# EAGLE design TestA (EAGLE 9.6.2)
IGNORE_RENUMBER: TP
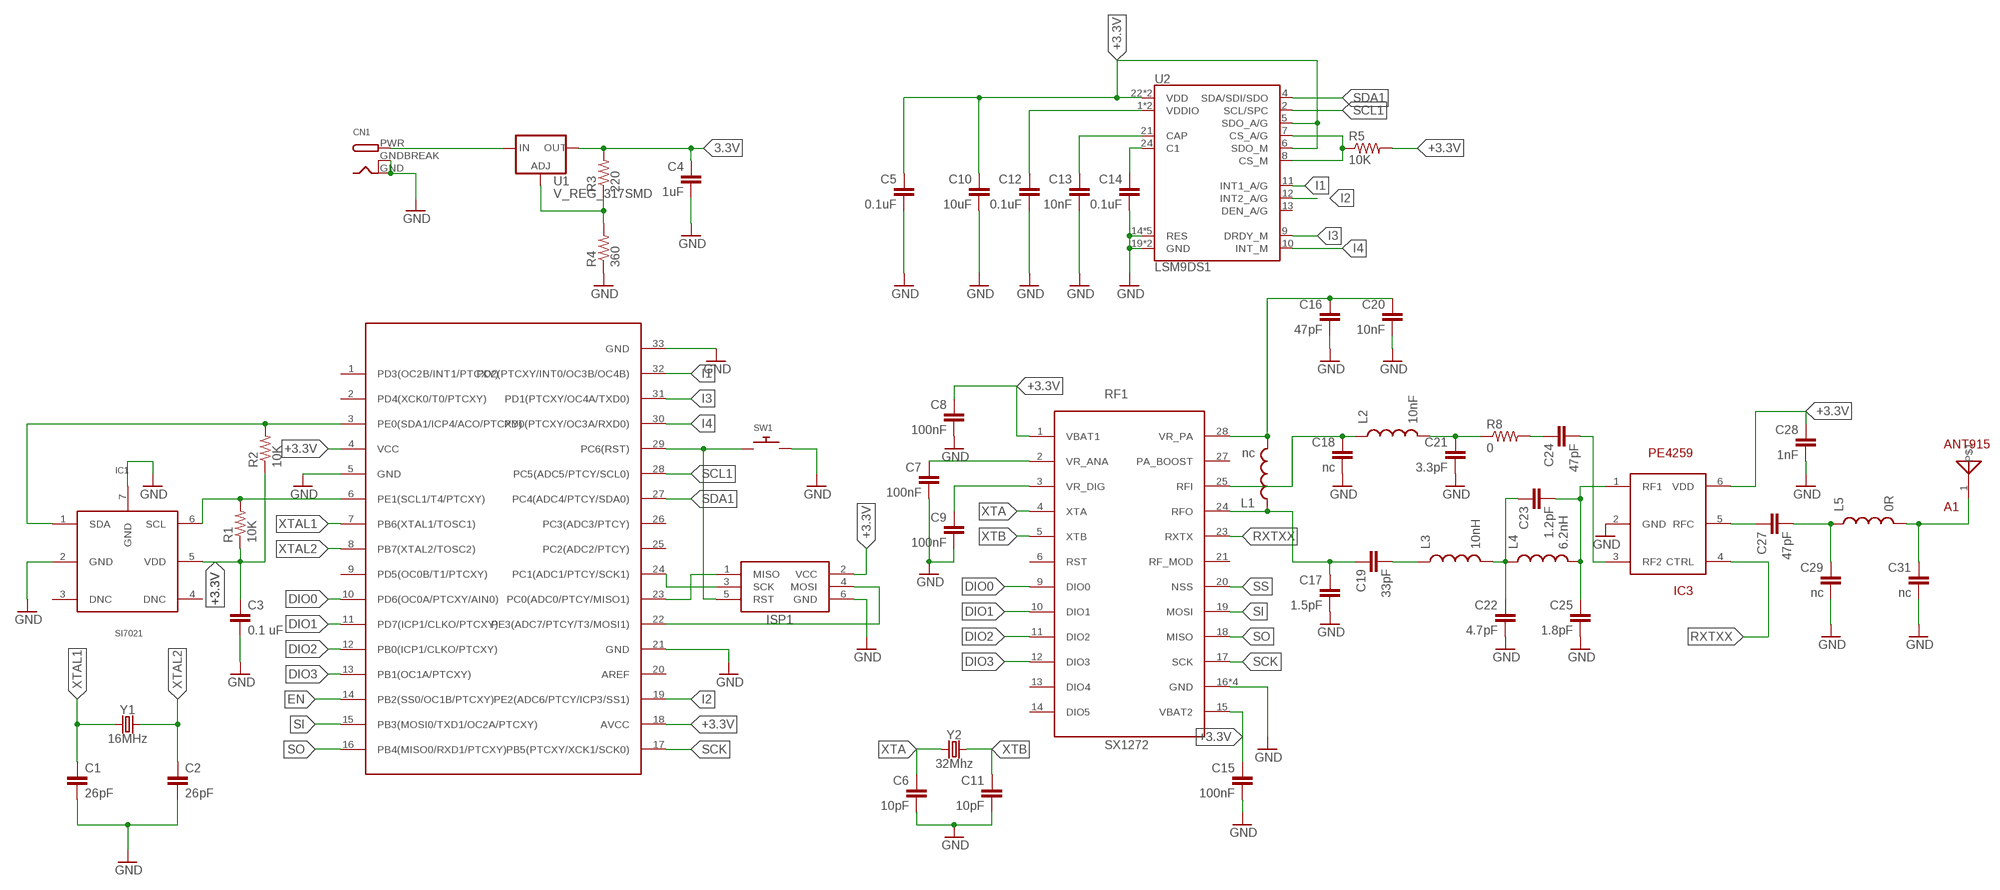
[diagram p0: schematic, sheet 1]

## Parts
A1  ANT915  [ANT915]
C1  26pF  CAP0402-CAP  [0402-CAP]
C2  26pF  CAP0402-CAP  [0402-CAP]
C3  0.1 uF  CAP0402-CAP  [0402-CAP]
C4  1uF  CAP0402-CAP  [0402-CAP]
C5  0.1uF  CAP0402-CAP  [0402-CAP]
C6  10pF  CAP0402-CAP  [0402-CAP]
C7  100nF  CAP0402-CAP  [0402-CAP]
C8  100nF  CAP0402-CAP  [0402-CAP]
C9  100nF  CAP0402-CAP  [0402-CAP]
C10  10uF  CAP0402-CAP  [0402-CAP]
C11  10pF  CAP0402-CAP  [0402-CAP]
C12  0.1uF  CAP0402-CAP  [0402-CAP]
C13  10nF  CAP0402-CAP  [0402-CAP]
C14  0.1uF  CAP0402-CAP  [0402-CAP]
C15  100nF  CAP0402-CAP  [0402-CAP]
C16  47pF  CAP0402-CAP  [0402-CAP]
C17  1.5pF  CAP0402-CAP  [0402-CAP]
C18  nc  CAP0402-CAP  [0402-CAP]
C19  33pF  CAP0402-CAP  [0402-CAP]
C20  10nF  CAP0402-CAP  [0402-CAP]
C21  3.3pF  CAP0402-CAP  [0402-CAP]
C22  4.7pF  CAP0402-CAP  [0402-CAP]
C23  1.2pF  CAP0402-CAP  [0402-CAP]
C24  47pF  CAP0402-CAP  [0402-CAP]
C25  1.8pF  CAP0402-CAP  [0402-CAP]
C27  47pF  CAP0402-CAP  [0402-CAP]
C28  1nF  CAP0402-CAP  [0402-CAP]
C29  nc  CAP0402-CAP  [0402-CAP]
C31  nc  CAP0402-CAP  [0402-CAP]
CN1  DCBARRELPTH  [DCJACK_2MM_PTH]
IC1  SI7021  [SI7021]
IC2  ATMEGA328-PB  [ATMEGA328-PB]
IC3  PE4259  [PE4259]
ISP1  AVRISP-6  [AVRISP]
L1  nc  INDUCTOR0402  [C0402]
L2  10nF  INDUCTOR0402  [C0402]
L3  10nH  INDUCTOR0402  [C0402]
L4  6.2nH  INDUCTOR0402  [C0402]
L5  0R  INDUCTOR0402  [C0402]
R1  10K  RESISTOR0402-RES  [0402-RES]
R2  10K  RESISTOR0402-RES  [0402-RES]
R3  220  RESISTOR0402-RES  [0402-RES]
R4  360  RESISTOR0402-RES  [0402-RES]
R5  10K  RESISTOR0402-RES  [0402-RES]
R8  0  RESISTOR0402-RES  [0402-RES]
RF1  SX1272  [SX1272]
SW1  SWITCH_PUSHBUTTONSOFTTOUCHSMD_SJ  [PUSHBUTTON_SMD_SJ]
U1  V_REG_317SMD  [SOT223]
U2  LSM9DS1  [LGA24-8X4]
Y1  16MHz  CRYSTAL-16MHZSMD-2X1.6  [CRYSTAL-SMD-2.0X1.6MM]
Y2  32Mhz  CRYSTAL-16MHZSMD-2X1.6  [CRYSTAL-SMD-2.0X1.6MM]

## Nets
3.3V: C4.1 R3.2 U1.2(OUT)
+3.3V: C3.1 C5.1 C8.1 C10.1 C15.1 C28.1 IC1.5(VDD) IC2.4(VCC) IC2.18(AVCC) IC3.6(VDD) ISP1.2(VCC) R1.1 R2.1 R5.2 RF1.1(VBAT1) RF1.15(VBAT2) U2.5(SDO_A/G) U2.6(SDO_M) U2.22(VDD) U2.23(VDD)
DIO0: IC2.10(PD6(OC0A/PTCXY/AIN0)) RF1.9(DIO0)
DIO1: IC2.11(PD7(ICP1/CLKO/PTCXY)) RF1.10(DIO1)
DIO2: IC2.12(PB0(ICP1/CLKO/PTCXY)) RF1.11(DIO2)
DIO3: IC2.13(PB1(OC1A/PTCXY)) RF1.12(DIO3)
EN: IC2.14(PB2(SS0/OC1B/PTCXY))
GND: C1.2 C2.2 C3.2 C4.2 C5.2 C6.2 C7.2 C8.2 C9.2 C10.2 C11.2 C12.2 C13.2 C14.2 C15.2 C16.2 C17.2 C18.2 C20.2 C21.2 C22.2 C25.2 C28.2 C29.2 C31.2 CN1.GND CN1.GNDBREAK IC1.2(GND) IC1.7(GND) IC2.5(GND) IC2.21(GND) IC2.33(GND) IC3.2(GND) ISP1.6(GND) R4.1 RF1.16(GND) RF1.22(GND) RF1.26(GND) RF1.29(GND) SW1.P$2 U2.14(RES) U2.15(RES) U2.16(RES) U2.17(RES) U2.18(RES) U2.19(GND) U2.20(GND)
I1: IC2.32(PD2(PTCXY/INT0/OC3B/OC4B)) U2.11(INT1_A/G)
I2: IC2.19(PE2(ADC6/PTCY/ICP3/SS1)) U2.12(INT2_A/G)
I3: IC2.31(PD1(PTCXY/OC4A/TXD0)) U2.9(DRDY_M)
I4: IC2.30(PD0(PTCXY/OC3A/RXD0)) U2.10(INT_M)
N$1: C24.1 R8.2
N$2: C16.1 C20.1 L1.2 RF1.28(VR_PA)
N$3: CN1.PWR U1.3(IN)
N$4: C24.2 IC3.3(RF2)
N$5: R5.1 U2.7(CS_A/G) U2.8(CS_M)
N$6: R3.1 R4.2 U1.1(ADJ)
N$7: C18.1 L2.1 RF1.25(RFI)
N$8: C13.1 U2.21(CAP)
N$9: C12.1 U2.1(VDDIO) U2.3(VDDIO)
N$10: C21.1 L2.2 R8.1
N$11: C17.1 C19.1 L1.1 RF1.24(RFO)
N$12: C22.1 C23.1 L3.2 L4.1
N$13: C19.2 L3.1
N$14: C23.2 C25.1 IC3.1(RF1) L4.2
N$15: A1.1 C31.1 L5.2
N$16: C27.1 IC3.5(RFC)
N$17: C14.1 U2.24(C1)
N$18: C27.2 C29.1 L5.1
N$22: IC2.29(PC6(RST)) ISP1.5(RST) SW1.P$1
N$23: IC2.24(PC1(ADC1/PTCY/SCK1)) ISP1.3(SCK)
N$24: C7.1 RF1.2(VR_ANA)
N$25: C9.1 RF1.3(VR_DIG)
N$26: IC2.23(PC0(ADC0/PTCY/MISO1)) ISP1.1(MISO)
N$27: IC2.22(PE3(ADC7/PTCY/T3/MOSI1)) ISP1.4(MOSI)
RXTXX: IC3.4(CTRL) RF1.23(RXTX)
SCK: IC2.17(PB5(PTCXY/XCK1/SCK0)) RF1.17(SCK)
SCL: IC1.6(SCL) IC2.6(PE1(SCL1/T4/PTCXY)) R1.2
SCL1: IC2.28(PC5(ADC5/PTCY/SCL0)) U2.2(SCL/SPC)
SDA: IC1.1(SDA) IC2.3(PE0(SDA1/ICP4/ACO/PTCXY)) R2.2
SDA1: IC2.27(PC4(ADC4/PTCY/SDA0)) U2.4(SDA/SDI/SDO)
SI: IC2.15(PB3(MOSI0/TXD1/OC2A/PTCXY)) RF1.19(MOSI)
SO: IC2.16(PB4(MISO0/RXD1/PTCXY)) RF1.18(MISO)
SS: RF1.20(NSS)
XTA: C6.1 RF1.4(XTA) Y2.1
XTAL1: C1.1 IC2.7(PB6(XTAL1/TOSC1)) Y1.1
XTAL2: C2.1 IC2.8(PB7(XTAL2/TOSC2)) Y1.3
XTB: C11.1 RF1.5(XTB) Y2.3
Unconnected: IC1.3(DNC) IC1.4(DNC) IC2.1(PD3(OC2B/INT1/PTCXY)) IC2.2(PD4(XCK0/T0/PTCXY)) IC2.9(PD5(OC0B/T1/PTCXY)) IC2.20(AREF) IC2.25(PC2(ADC2/PTCY)) IC2.26(PC3(ADC3/PTCY)) RF1.6(RST) RF1.13(DIO4) RF1.14(DIO5) RF1.21(RF_MOD) RF1.27(PA_BOOST) U2.13(DEN_A/G)

## Library data of the parts
A1 = Mini-Project:ANT915
C1-C25 C27-C29 C31 = SparkFun:CAP: Capacitor Standard 0603 ceramic capacitor, and 0.1" leaded capacitor.
CN1 = adafruit:DCBARREL: 2.0mm DC Barrel Jack DCJACK_2MM_PTH - Through Hole Jack (4UConnector: 05537)
IC1 = Mini-Project:SI7021
IC2 = Mini-Project:ATMEGA328-PB
IC3 = Mini-Project:PE4259
ISP1 = adafruit:AVRISP: AVR ISP HEADER Standard 6 pin header for AVR programming
L1-L5 = SparkFun:INDUCTOR: Inductors Basic Inductor/Choke - 0603 and 1206. Footprints are not proven and vary greatly between part numbers.
R1-R5 R8 = SparkFun:RESISTOR: Resistor Basic schematic elements and footprints for 0603, 1206, and PTH resistors.
RF1 = Mini-Project:SX1272
SW1 = adafruit:SWITCH_PUSHBUTTON: Buttons SOFTTOUCHSMD_SJ - Soft touch temporary push button (Super Junk Akihabara) Compatible with SKPMANE010 [Mouser: 688-SKPMAN] C&K_KSS = Digikey: KSS221GLFS
U1 = SparkFun:V_REG_317: Voltage Regulator Standard LM317 adjustable voltage regulator. AOI (Adjust Output Input). Google 'LM317 Calculator' for easy to use app to get the two resistor values needed. 240/720 for 5V output. 240/390 for 3.3V output. Spark Fun Electronics SKU : COM-00527
U2 = LSM9DS1:LSM9DS1: LSM9DS1 3D accelerometer, gyroscope & magnetometer The LSM9DS1 is a system-in-package featuring a 3D digital linear acceleration sensor, a 3D digital angular rate sensor, and a 3D digital magnetic sensor. The LSM9DS1 has a linear acceleration full scale of ±2g/±4g/±8/±16 g, a magnetic field full scale of ±4/±8/±12/±16 gauss and an angular rate of ±245/±500/±2000 dps. The LSM9DS1 includes an I2 C serial bus interface supporting standard and fast mode (100 kHz and 400 kHz) and an SPI serial standard interface. Magnetic, accelerometer and gyroscope sensing can be enabled or set in power-down mode separately for smart power management. The LSM9DS1 is available in a plastic land grid array package (LGA) and it is guaranteed to operate over an extended temperature range from -40 °C to +85 °C.; PROD_ID: IC-12536
Y1 = SparkFun-Clocks:CRYSTAL-16MHZ: 16MHz Crystal Digikey Example <http://www.digikey.com/product-search/en?keywords=535-9122-1-ND> Frequency: 16MHz Frequency Stability: ±50ppm Frequency Tolerance: ±20ppm Load Capacitance: 18pF SparkFun Products: Pro Micro -5V/16MHz <https://www.sparkfun.com/products/12640> SparkFun Serial Enabled LCD Kit <https://www.sparkfun.com/products/10097>; PROD_ID: XTAL-14681
Y2 = SparkFun-Clocks:CRYSTAL-16MHZ: 16MHz Crystal Digikey Example <http://www.digikey.com/product-search/en?keywords=535-9122-1-ND> Frequency: 16MHz Frequency Stability: ±50ppm Frequency Tolerance: ±20ppm Load Capacitance: 18pF SparkFun Products: Pro Micro -5V/16MHz <https://www.sparkfun.com/products/12640> SparkFun Serial Enabled LCD Kit <https://www.sparkfun.com/products/10097>; PROD_ID: XTAL-14681; VALUE: 16MHz

## Board
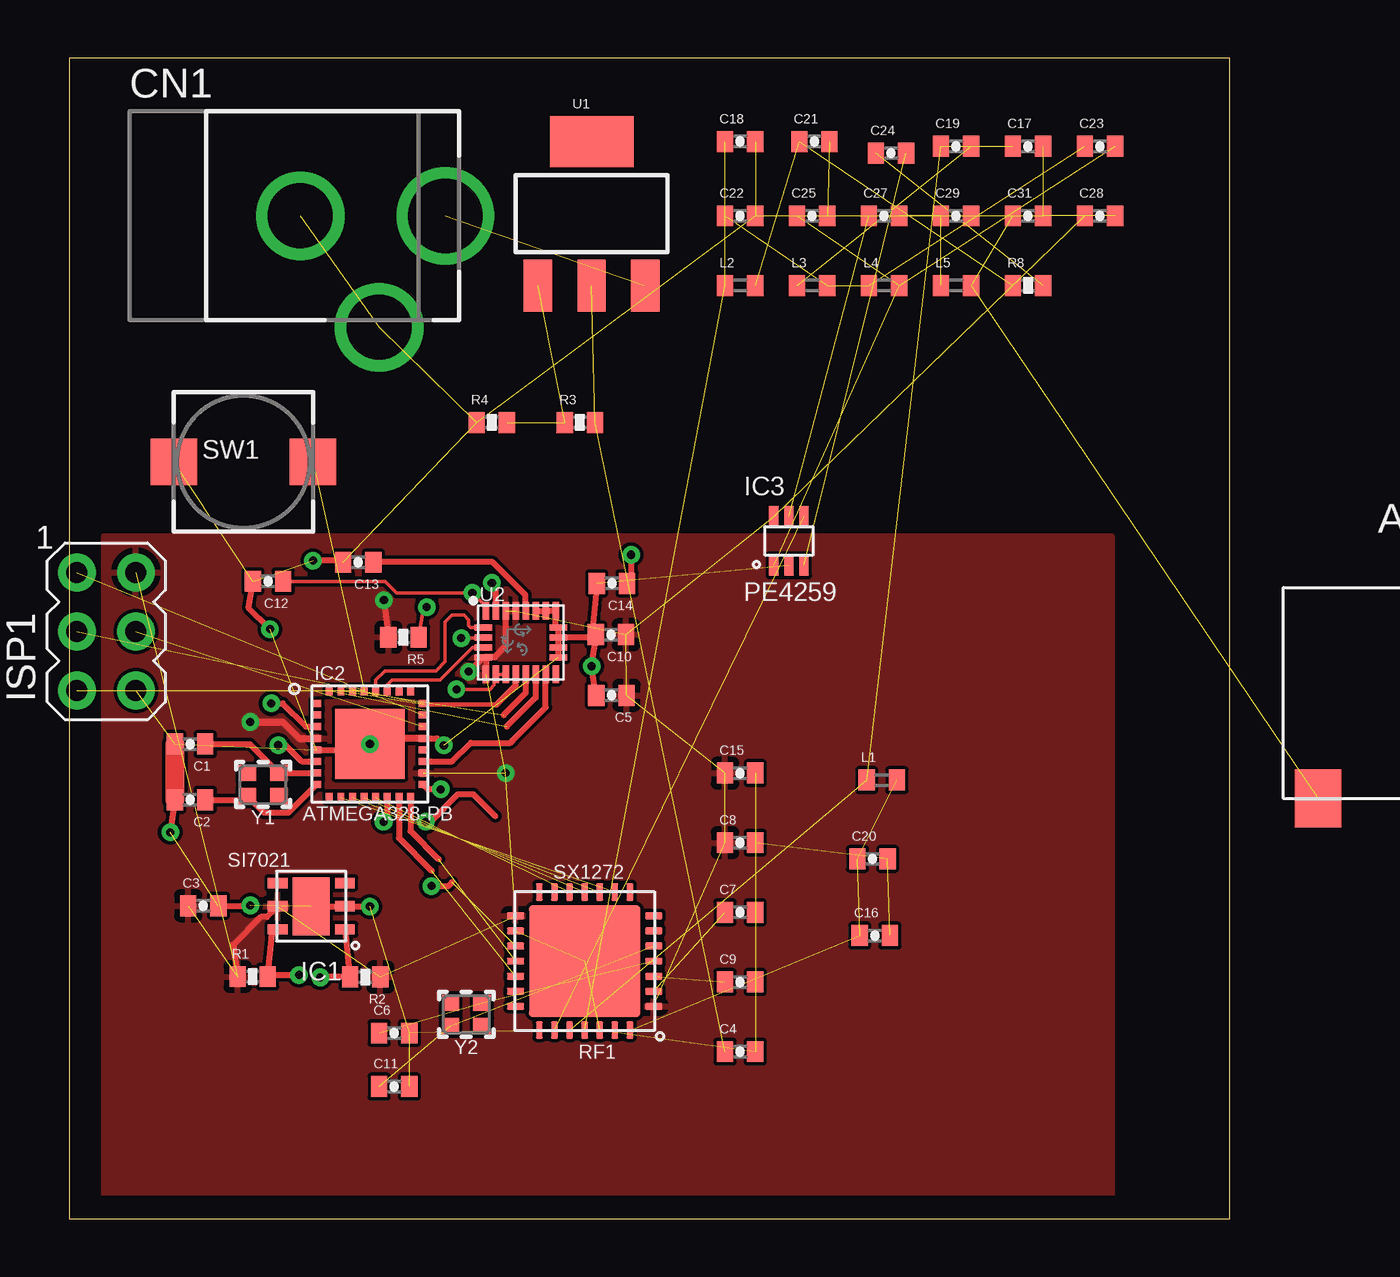
[diagram p1: board, top side]
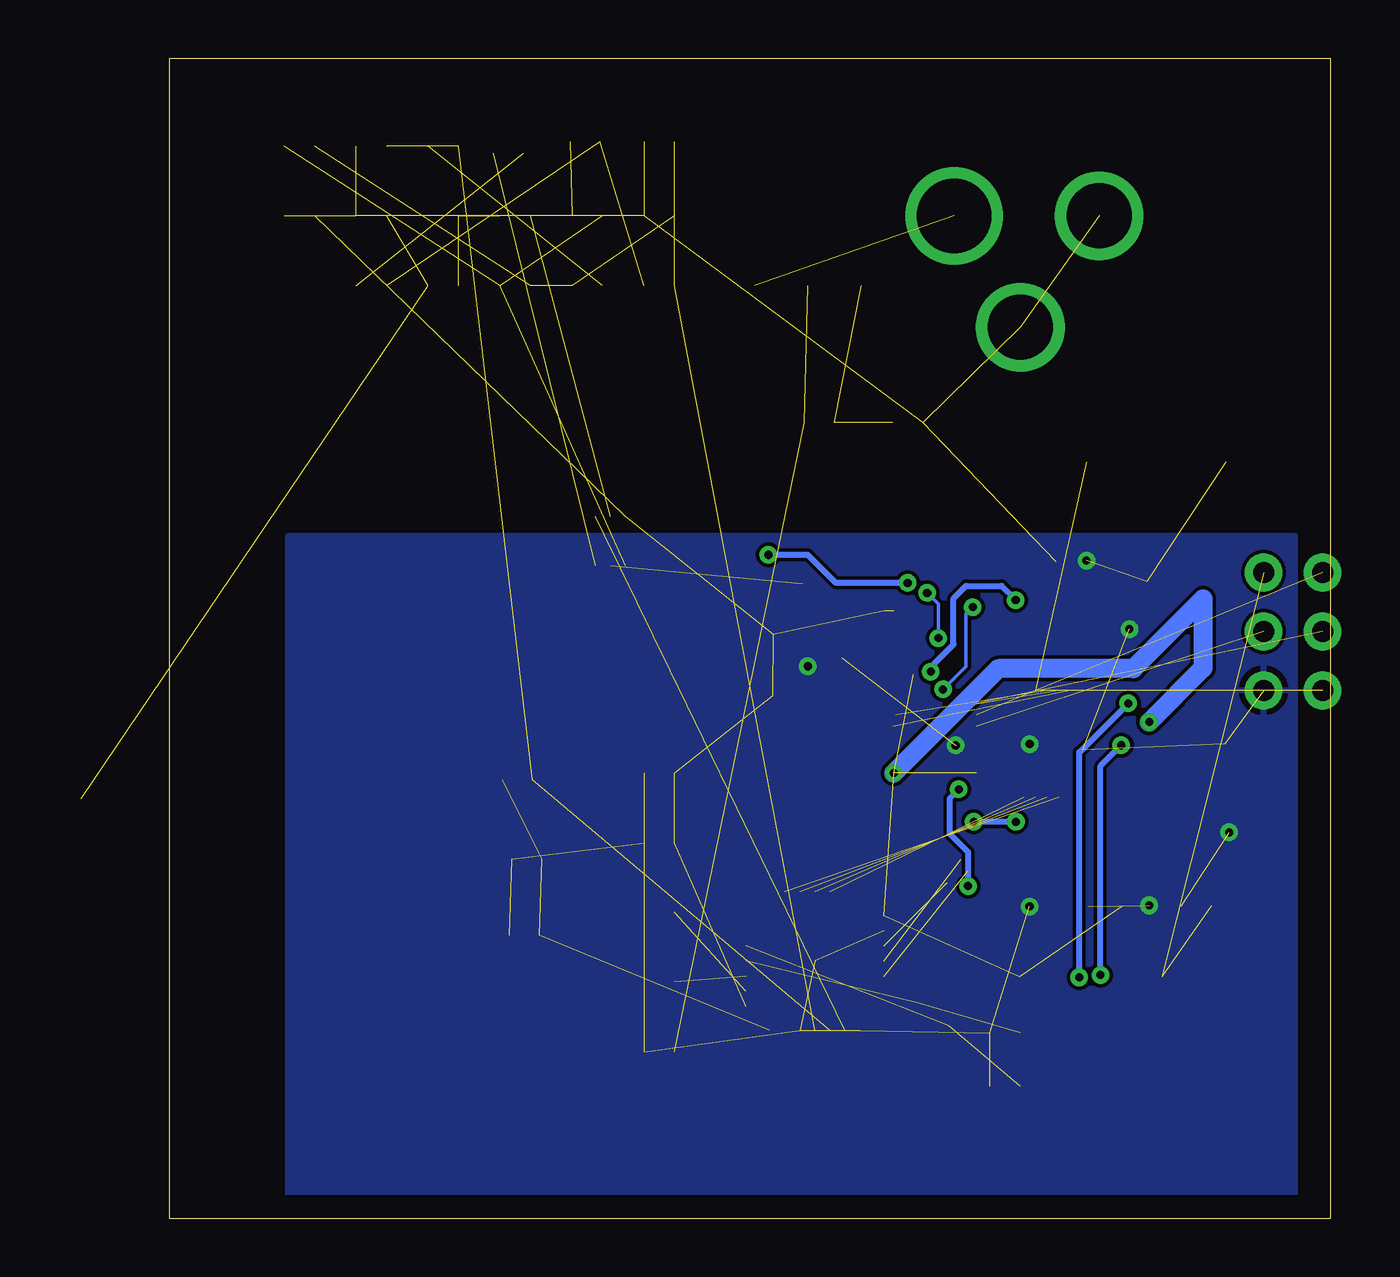
[diagram p2: board, bottom side, seen from below]

Size 50 x 50 mm. Coordinates in mm from the lower left corner, seen from the top.
Outline: 0,0 50,0 50,50 0,50 0,0
Copper layers (1*16): Top 0.035mm / dielectric 1.5mm / Bottom 0.035mm
Design rules "default": minimum track width 6mil, minimum drill 0.35mm, track to track 6mil, track to pad 6mil, pad to pad 6mil, via to via 6mil, smd to smd 6mil, copper to edge 40mil, drill to drill 6mil, minimum pad ring 10mil, minimum via ring 8mil, stop-mask expansion 4mil, vias tented up to drill 0mil, thermal gap 10mil

### Footprints (pad centres in the part's own frame; a part is rotated, then mirrored left to right if it is on the bottom)
ANT915 = smd 2 x 2.5: 1 -5.1,0; 2 5.1,0
0402-CAP = smd 0.7 x 0.9: 1 -0.65,0; 2 0.65,0
DCJACK_2MM_PTH = drill 2.8: GND 0,7.35; GNDBREAK 4.8,10.75 | drill 3.2: PWR 0,13.6
SI7021 = smd 0.85 x 0.45: 1 -1.45,1; 2 -1.45,0; 3 -1.45,-1; 4 1.45,-1; 5 1.45,0; 6 1.45,1 | smd 1.6 x 2.5: 7 0,0
ATMEGA328-PB = smd 0.4 x 0.3: 1 -2.3,1.75; 2 -2.3,1.25; 3 -2.3,0.75; 4 -2.3,0.25; 5 -2.3,-0.25; 6 -2.3,-0.75; 7 -2.3,-1.25; 8 -2.3,-1.75; 17 2.3,-1.75; 18 2.3,-1.25; 19 2.3,-0.75; 20 2.3,-0.25; 21 2.3,0.25; 22 2.3,0.75; 23 2.3,1.25; 24 2.3,1.75 | smd 0.3 x 0.4: 9 -1.75,-2.3; 10 -1.25,-2.3; 11 -0.75,-2.3; 12 -0.25,-2.3; 13 0.25,-2.3; 14 0.75,-2.3; 15 1.25,-2.3; 16 1.75,-2.3; 25 1.75,2.3; 26 1.25,2.3; 27 0.75,2.3; 28 0.25,2.3; 29 -0.25,2.3; 30 -0.75,2.3; 31 -1.25,2.3; 32 -1.75,2.3 | smd 3 x 3: 33 0,0
PE4259 = smd 0.4 x 0.9: 1 -0.65,-1.05; 2 0,-1.05; 3 0.65,-1.05; 4 0.65,1.05; 5 0,1.05; 6 -0.65,1.05
AVRISP = drill 0.9 pad 1.626: 1 -1.27,2.54; 2 1.27,2.54; 3 -1.27,0; 4 1.27,0; 5 -1.27,-2.54; 6 1.27,-2.54
C0402 = smd 0.7 x 0.9: 1 -0.65,0; 2 0.65,0
0402-RES = smd 0.7 x 0.9: 1 -0.65,0; 2 0.65,0
SX1272 = smd 0.75 x 0.3: 1 -2.975,1.95; 2 -2.975,1.3; 3 -2.975,0.65; 4 -2.975,0; 5 -2.975,-0.65; 6 -2.975,-1.3; 7 -2.975,-1.95; 15 2.975,-1.95; 16 2.975,-1.3; 17 2.975,-0.65; 18 2.975,0; 19 2.975,0.65; 20 2.975,1.3; 21 2.975,1.95 | smd 0.3 x 0.75: 8 -1.95,-2.975; 9 -1.3,-2.975; 10 -0.65,-2.975; 11 0,-2.975; 12 0.65,-2.975; 13 1.3,-2.975; 14 1.95,-2.975; 22 1.95,2.975; 23 1.3,2.975; 24 0.65,2.975; 25 0,2.975; 26 -0.65,2.975; 27 -1.3,2.975; 28 -1.95,2.975 | smd 4.8 x 4.8: 29 0,0
PUSHBUTTON_SMD_SJ = smd 2 x 2: P$1 3,0; P$2 -3,0
SOT223 = smd 1.219 x 2.235: 1 -2.311,-3.099; 2 0,-3.099; 3 2.311,-3.099 | smd 3.6 x 2.2: 4 0,3.099
LGA24-8X4 = smd 0.27 x 0.75: 1 -1.505,1.365; 6 -1.505,-1.365; 7 -1.075,-1.365; 8 -0.645,-1.365; 9 -0.215,-1.365; 10 0.215,-1.365; 11 0.645,-1.365; 12 1.075,-1.365; 13 1.505,-1.365; 18 1.505,1.365; 19 1.075,1.365; 20 0.645,1.365; 21 0.215,1.365; 22 -0.215,1.365; 23 -0.645,1.365; 24 -1.075,1.365 | smd 0.75 x 0.27: 2 -1.615,0.645; 3 -1.615,0.215; 4 -1.615,-0.215; 5 -1.615,-0.645; 14 1.615,-0.645; 15 1.615,-0.215; 16 1.615,0.215; 17 1.615,0.645
CRYSTAL-SMD-2.0X1.6MM = smd 0.75 x 0.7: 1 -0.675,-0.5; 2 0.675,-0.5; 3 0.675,0.5; 4 -0.675,0.5

### Placement (x,y rotation side)
A1  58.9,18.1 0 top  (outside the outline)
C1  5.2,20.45 180 top
C2  5.2,18.05 180 top
C3  5.78,13.48 0 top
C4  28.9,7.2 0 top
C5  23.35,22.55 180 top
C6  14,8 0 top
C7  28.9,13.2 0 top
C8  28.9,16.2 0 top
C9  28.9,10.2 0 top
C10  23.34,25.16 180 top
C11  14,5.7 0 top
C12  8.56,27.46 180 top
C13  12.45,28.28 180 top
C14  23.38,27.37 180 top
C15  28.9,19.2 0 top
C16  34.7,12.2 0 top
C17  41.3,46.2 0 top
C18  28.9,46.4 0 top
C19  38.2,46.2 0 top
C20  34.6,15.5 0 top
C21  32.1,46.4 0 top
C22  28.9,43.2 0 top
C23  44.4,46.2 0 top
C24  35.4,45.9 0 top
C25  32,43.2 0 top
C27  35.1,43.2 0 top
C28  44.4,43.2 0 top
C29  38.2,43.2 0 top
C31  41.3,43.2 0 top
CN1  2.6,43.2 270 top
IC1  10.43,13.46 180 top
IC2  12.95,20.45 0 top
IC3  31,29.2 0 top
ISP1  1.6,25.3 0 top
L1  35,18.9 0 top
L2  28.9,40.2 0 top
L3  32,40.2 0 top
L4  35.1,40.2 0 top
L5  38.2,40.2 0 top
R1  7.9,10.43 0 top
R2  12.75,10.41 180 top
R3  22,34.3 0 top
R4  18.2,34.3 0 top
R5  14.4,25.05 180 top
R8  41.3,40.2 0 top
RF1  22.2,11.1 180 top
SW1  7.5,32.6 0 top
U1  22.5,43.3 0 top
U2  19.45,24.82 0 top
Y1  8.35,18.7 180 top
Y2  17.1,8.8 180 top

### Tracks (layer width: path | path; a pad name or v marks a point on that pad's centre or on a via)
3.3V  (2 unrouted)
+3.3V  (via drill 0.35)  (15 unrouted)
  Top 0.254: IC1.5 8.51,13 8.25,13 7.05,11.8 R1.1 | U2.5 17.84,24.15 17.88,24.19 18.33,24.19 18.8,24.67 U2.23 | U2.5 17.95,24.07 U2.6 | U2.5 17.23,23.57 v17.2,23.57 | v13.55,26.65 R5.2
  Top 0.305: v7.8,21.4 9.2,21.4 9.9,20.7 IC2.4
  Bottom 0.254: v17.2,23.57 17.2,23.77 16.23,24.74 16.23,26.72 15.69,27.26 14.16,27.26 v13.55,26.65
  Bottom 0.813: v7.8,21.4 5.48,23.72 5.48,26.7 8.48,23.7 14.3,23.7 v18.8,19.2
  pour Top: 1.5,29.4 44.9,29.4 44.9,0 1.5,0
DIO0  (1 unrouted)
DIO1  (1 unrouted)
DIO2  (1 unrouted)
DIO3  (1 unrouted)
EN  (via drill 0.35 pad 0.55)
  Top 0.254: IC2.14 13.7,17.26 v13.54,17.1 | v15.36,17.1 15.56,17.1 16.76,18.3 17.4,18.3 18.36,17.34
  Bottom 0.254: v13.54,17.1 v15.36,17.1
GND  (via drill 0.35, 0.35 pad 0.55)  (33 unrouted)
  Top 0.152: 22.48,23.82 v22.5,23.8
  Top 0.254: U2.14 U2.15 U2.16 | C5.2 v22.5,23.8 | C10.2 22.48,23.82 | U2.16 U2.17 20.95,25.57 U2.18 U2.19 U2.20 | C10.2 22.36,25.04 U2.16 | C14.2 22.52,25.2 C10.2 | C13.2 11.53,28.35 v10.5,28.35 | v8.65,25.4 7.71,26.34 C12.2 | IC2.21 15.83,20.7 v16.14,20.39 | v12.95,13.45 12.94,13.46 IC1.2 IC1.7 | C3.2 7.78,13.48 v7.8,13.5 | C2.2 v4.35,16.65 | IC2.5 12.7,20.2 IC2.33
  Top 0.305: IC2.21 13.2,20.7 IC2.33
  Top 0.813: C1.2 C2.2
  other vias: 12.95,20.45
  pour Bottom: 1.5,29.4 44.9,29.4 44.9,0 1.5,0
I1  (1 unrouted)
  Top 0.254: U2.11 20.09,22.45 18.84,21.2
I2
  Top 0.254: IC2.19 16.5,19.7 17.3,20.5 19,20.5 19.1,20.6 20.52,22.02 U2.12
I3  (1 unrouted)
  Top 0.203: 18.41,22.15 15.3,22.15
  Top 0.254: 18.41,22.15 19.23,22.98 U2.9
I4  (1 unrouted)
  Top 0.254: U2.10 19.66,22.65 18.71,21.7
N$1  (1 unrouted)
N$2  (3 unrouted)
N$3  (1 unrouted)
N$4  (1 unrouted)
N$5  (via drill 0.35 pad 0.55)
  Top 0.152: U2.8 U2.7 18.31,23.39 18.31,22.98 18.13,22.81 v16.68,22.81 | v15.4,26.35 15.25,26.2 R5.1
  Bottom 0.152: v16.68,22.81 15.7,23.79 15.7,26.05 v15.4,26.35
N$6  (2 unrouted)
N$7  (2 unrouted)
N$8
  Top 0.254: U2.21 19.65,26.2 19.65,26.87 18.24,28.28 C13.1
N$9  (via drill 0.35 pad 0.55)
  Top 0.152: C12.1 13.61,27.46 14.11,26.96 v17.36,26.96 17.95,26.38 U2.1 | U2.3 17.82,25.02 v16.89,25.02
  Bottom 0.152: v16.89,25.02 16.89,26.48 v17.36,26.96
N$10  (2 unrouted)
N$11  (3 unrouted)
N$12  (3 unrouted)
N$13  (1 unrouted)
N$14  (3 unrouted)
N$15  (2 unrouted)
N$16  (1 unrouted)
N$17  (via drill 0.35)
  Top 0.254: U2.24 18.38,27.22 v18.2,27.39 | v24.2,28.6 24.2,27.39 C14.1
  Bottom 0.254: v18.2,27.39 21.29,27.39 22.5,28.6 v24.2,28.6
N$18  (2 unrouted)
N$22  (2 unrouted)
N$23  (1 unrouted)
N$24  (1 unrouted)
N$25  (1 unrouted)
N$26  (1 unrouted)
N$27  (1 unrouted)
RXTXX  (1 unrouted)
SCK  (via drill 0.35 pad 0.55)  (1 unrouted)
  Top 0.254: IC2.17 15.45,18.5 v16,18.5 | v15.6,14.33 16.33,14.33 16.49,14.49
  Bottom 0.254: v16,18.5 16.4,18.1 16.4,16.6 15.6,15.8 v15.6,14.33
SCL  (via drill 0.35)
  Top 0.254: IC1.6 8.75,12.24 R1.2 8.82,10.5 v9.9,10.5 | v9,20.4 9.3,20.4 10,19.7 IC2.6
  Bottom 0.254: v9.9,10.5 9.9,19.5 v9,20.4
SCL1
  Top 0.152: IC2.28 13.2,23.2 13.6,23.6 15.8,23.6 16.2,24 16.2,25.7 16.5,26 17,26 17.2,25.8 17.2,25.56 17.29,25.46 U2.2
SDA  (via drill 0.35)
  Top 0.2: 11.88,12.43 IC1.1
  Top 0.254: 11.88,12.43 11.9,12.4 R2.2 10.82,10.41 v10.81,10.4 | v8.7,22.2 9.2,22.2 10.2,21.2 IC2.3
  Bottom 0.254: v10.81,10.4 10.81,20.09 v8.7,22.2
SDA1
  Top 0.152: IC2.27 13.7,23 13.9,23.2 15.98,23.2 17.38,24.61 U2.4
SI  (1 unrouted)
  Top 0.254: IC2.15 14.2,16.4 15.61,14.99
SO  (1 unrouted)
  Top 0.254: IC2.16 14.7,16.7 15.91,15.49
XTA  (2 unrouted)
XTAL1
  Top 0.254: IC2.7 Y1.1 7.78,20.45 C1.1
XTAL2
  Top 0.254: Y1.3 7.69,18.19 | 7.69,18.19 8.38,17.5 9.45,17.5 IC2.8 | C2.1 7.55,18.05 7.69,18.19
XTB  (2 unrouted)